# Altium schematic sheet POWER.SchDoc
size A4; SheetNumber: 2; SheetTotal: 5; SPICEModelCachePKFPWWXS: <root> / <DocumentId>PKFPWWXS</DocumentId> / <CacheFrame Number="0"> / <Model Name="tps563203_trans" Kind="CKT"> / <Text>.subckt TPS563203_TRANS VIN EN SW BST FB GND / $CDNENCSTART_ADV2 / 17f62b1fb318c25603aeb85644ae98a5d179ef807807791f6459efacb9d7ffc37a831b146dc0f06bb1ef275619162e6d8f7ad0dc708bf15ae1a1d5bd0ae623b2 / f5afd0814d8bce86ea78a61edec6d2fc1ef88bc1fe4191fb8493f4a1dd412c6bfb556be8eedb1c8ddeadffc7dd6d7cd49302c9ec7f2869ca6368ab961b9a7e79 / 2c3caf852e6007bbddfbf300b299ce4504324c546a147b82d0fd63f5f73843b5b280bb0094f9cbf6b3bb75c137eb341da51f01e1692a3f0f5357ab21ec91e28c / 2f9c76df3eefb0486bf406cd6610b812bbdef3e70d781d9ce92ba7e3f4ab8afcff2d350bbc5023681e434812074fc469fe32530ce609babdc5faa606e67e9fb5 / 70cd83725f11bc1d42e8f6733e572335c412d0e20c1d7b58214fab9eb971615763cfb3c0014b2c811add8fe5f9049282accfe11765fcb6e03701656a7ec52731 / 09bd5129c94fd3d1201b494b70afa0de60d519adf9c275ea91e8124cf70f7fa7d3b30d73fe18ddb3b40ed0a75a54c78474184e2e8b85f295eb1b3c583ef923ce / 00b83487d06f71d6f0df47a17d670e0be39eeb4d6b56bf5c6430b777c84afb9d5f327ec42498cd38024eec905a348ac82d1d589fbdc3bab015abe947d6641a42 / 36ae12f33cc0446c27b459f3dd9d5fe9da1a1277d26cdcd58a824dcbec775f4e001e6179323f31a8fcd778321d994c776ec64628f32549d1a1795120678f9f61 / 61cb9888109311ca70b8c88ae46acf6a6984f94c16c358e27027524eed01821c5fb1a81617d1d271dd181321ec41a8c96f51b1282e3dbbbae662381c2be3603a / 91b1db793b986c20ddaa8a593450d67c6984f94c16c358e27027524eed01821c5fb1a81617d1d271dd181321ec41a8c96f51b1282e3dbbbae662381c2be3603a / 4362db170fc37876f0ba3a6f255327846e0423a446892e94341c20b5ed873635253e8ea9ebb14128faf3f61aeb5d6afdf53afeecc7698bc2fda5d708d793a7ad / 45f3f38a949db782cf0a37a34cb4b1afce777453a0f5ceb5cf4270f6cd20a87c5f327ec42498cd38024eec905a348ac82d1d589fbdc3bab015abe947d6641a42 / 35475fea8b6c255631cab15e8359acc7ce777453a0f5ceb5cf4270f6cd20a87c5f327ec42498cd38024eec905a348ac82d1d589fbdc3bab015abe947d6641a42 / 85fc3fcf19e6aba9aec09af889a207db0b1b89f2cf1298d1f772fa66272e242b5fb1a81617d1d271dd181321ec41a8c96f51b1282e3dbbbae662381c2be3603a / b53cf1d4447459acdeb16b257739f88287818d550347068855ae43d551e3972173db23d861834f35706d19cd4d2361b0e892a58128de06ead42d55be8bd4092e / fde6055fa021b00159f13ed1c1b4f06cc482cdc201d5a3b43cf75803bebdd0beff5631291e78e480e41d0c5964bce8f4c60929daf44343f14daf150167c2d41a / 4cceda455955eacfd49dcb37552de3b40a953a0f07ffedcd5efa84074414a06c5fb1a81617d1d271dd181321ec41a8c96f51b1282e3dbbbae662381c2be3603a / 8ef4f3bd401a0db98afcf172f2968199212162ca8b8e19f4a5fb964338ddb170ddf3b01d73c364b8559f1cf0a40d6b2a1554413396a84c7eaa5464e7e001ac94 / 122342c2634d6b235b81d85b98ae33c0fa0ba6454dc997795c7cbef7cb3090545fb1a81617d1d271dd181321ec41a8c96f51b1282e3dbbbae662381c2be3603a / 92b245e73f4697285388a60cc54d1a2cf9d5cae23754c4b7973eee563277a269253e8ea9ebb14128faf3f61aeb5d6afdf53afeecc7698bc2fda5d708d793a7ad / b030d7f7ec807e80809a33f1e0f48d4304324c546a147b82d0fd63f5f73843b5b280bb0094f9cbf6b3bb75c137eb341da51f01e1692a3f0f5357ab21ec91e28c / a356f56b2f5efac4a113c10908a407c81ef88bc1fe4191fb8493f4a1dd412c6bfb556be8eedb1c8ddeadffc7dd6d7cd49302c9ec7f2869ca6368ab961b9a7e79 / 27577699ac96bfd769dc9ea3ff693bc054f6809f3ba2a338ae8531f223b014c163cfb3c0014b2c811add8fe5f9049282accfe11765fcb6e03701656a7ec52731 / f1da5c1c6c3fdc08c0322d47b68b6b910220e3ffea48d2478756907be69c361673db23d861834f35706d19cd4d2361b0e892a58128de06ead42d55be8bd4092e / 67ecfaa4447f34c7c0e4d59d6a34ae7d471c010d6c737d18210cc87266cf9601ff5631291e78e480e41d0c5964bce8f4c60929daf44343f14daf150167c2d41a / 4ee0a4f9940f90595435acb177473875049e4d6e50b273c83d53f3344d12762ef3a2b41ec0981b66f3ef9d7a49aefae833476f48602ca5add898620fb19febff / edbe8b41d2123721c70019bda266bd8a5d931c3789abc7c3dae88db9400efed35f327ec42498cd38024eec905a348ac82d1d589fbdc3bab015abe947d6641a42 / 574afbb14df61a9f99b8b4dfcf41013904324c546a147b82d0fd63f5f73843b5b280bb0094f9cbf6b3bb75c137eb341da51f01e1692a3f0f5357ab21ec91e28c / e3ee849839cf8fbd7594fd65ad47596fcc5ade9bf6ee20565b33cd6cc89886dd81ad21904c09afefe4e5be9d748c6f54dd6f10503e95471e00df778ebffc6776 / 22ddd3cc22c031ccef5b54aeb4248bf504324c546a147b82d0fd63f5f73843b5b280bb0094f9cbf6b3bb75c137eb341da51f01e1692a3f0f5357ab21ec91e28c / b2d692de5fb57b84ecc629e48fe2e2771ee6ee674cc49299988836ede0e32a97c3f62e6a4283e53726ebfad0bdd19fc0351ff4d82b7fddd9310a450595235bfc / aaad54eddd7ce6c56d24dbcb22fb4b351ef88bc1fe4191fb8493f4a1dd412c6bfb556be8eedb1c8ddeadffc7dd6d7cd49302c9ec7f2869ca6368ab961b9a7e79 / 5bc514dc2514d2d59b213b2e62bb1d6e4e9f666838d97e63a805ec55b0ea05d363cfb3c0014b2c811add8fe5f9049282accfe11765fcb6e03701656a7ec52731 / 42bde815bd9b10b9213acaf4a66cac3f4e9f666838d97e63a805ec55b0ea05d363cfb3c0014b2c811add8fe5f9049282accfe11765fcb6e03701656a7ec52731 / fd8ccb6aec6d817fbd7a50fb501fdaa26f0d06708f190010035fffa3d65560ef81ad21904c09afefe4e5be9d748c6f54dd6f10503e95471e00df778ebffc6776 / 2a7f0c58233275ce3330073e8b2ad1055acf8296a5506a731d449097f377703963cfb3c0014b2c811add8fe5f9049282accfe11765fcb6e03701656a7ec52731 / 4bb5198366fb4abcb65e13b5804e97816f0d06708f190010035fffa3d65560ef81ad21904c09afefe4e5be9d748c6f54dd6f10503e95471e00df778ebffc6776 / 8d523741b204ed9c0873bb14b6a448136f0d06708f190010035fffa3d65560ef81ad21904c09afefe4e5be9d748c6f54dd6f10503e95471e00df778ebffc6776 / c75098833f219e02c4cb522a54a2a4d04e9f666838d97e63a805ec55b0ea05d363cfb3c0014b2c811add8fe5f9049282accfe11765fcb6e03701656a7ec52731 / 3046f13968968d76bf373e22f2b2e0ee1ef88bc1fe4191fb8493f4a1dd412c6bfb556be8eedb1c8ddeadffc7dd6d7cd49302c9ec7f2869ca6368ab961b9a7e79 / ad726412a80e463f9526607072df080804324c546a147b82d0fd63f5f73843b5b280bb0094f9cbf6b3bb75c137eb341da51f01e1692a3f0f5357ab21ec91e28c / b80c999929450a3e27ab9264f990ec3fcc5ade9bf6ee20565b33cd6cc89886dd81ad21904c09afefe4e5be9d748c6f54dd6f10503e95471e00df778ebffc6776 / 29dbb7f9bc452ef428e53ef30004d2887763b9c705b2ca7bb0892466e755206263cfb3c0014b2c811add8fe5f9049282accfe11765fcb6e03701656a7ec52731 / 89bbde81fddca67a93411e8fac86d3484e9f666838d97e63a805ec55b0ea05d363cfb3c0014b2c811add8fe5f9049282accfe11765fcb6e03701656a7ec52731 / e37be5c7bcada9f51e1fb646d4e5305c5acf8296a5506a731d449097f377703963cfb3c0014b2c811add8fe5f9049282accfe11765fcb6e03701656a7ec52731 / bc290469ae2485b9f59860eeabffd1c3ae6eb3a6f20880f9757070053acb987c125811c553e3706b56cbd9a7d47fd599b92102186ad864fe0340588da61aa7a9 / 4f40bc9a0008bc6ff2c645645814ad4338f1fe869ea9ebd1f0ae365fa2011b52915e194a6e7710d6db70b166fa35f8dd670dadfa707a887d746ceb41a6a2bc50 / bd729cb5005c2288df15d1dc550c56fe253e8ea9ebb14128faf3f61aeb5d6afd98822bcc9d595e64d500b4de883b9f539930e10cdbd75d1f68c5e1b6488d495d / 443c1c3e040ad688d7c48ca25096a42c0f3eff7fcc807c3432ad9355abaa33bce4b1f018dad504a3a21a72b65e0dff24b92102186ad864fe0340588da61aa7a9 / 4f40bc9a0008bc6ff2c645645814ad43c0c801c380cd0a71ce3ecd7eb44ac2d5d8c8fee6ced1ee553bc7668303dad3b01995e07a960544f44eae0b9dd0bc7a34 / 850cc5dfca7143c35a7806b5e1804bd7534d047b85e7d209f8469abfd01aa604ece169451ba8821a320cf88dedd1918b982bac6ba592e8e43e804b398337b6ff / 935b2a1b30a21fa18bed7288b9ab5e324a88271ab3266812cd3aa70708bd626445b85c27301d5c6b578db1a92feeaa764865724ffc30b5e8dbca37a731b4efc3 / 4f40bc9a0008bc6ff2c645645814ad43fbc146bbd8c7709f893e653873e404e5153afabf42e2508eeeb0b7a6a6b86e6dd6f3a0a6306c81c6c3076feec66dbaa1 / 01186e5929d2f904bf9fda6b558de5cbddf3b01d73c364b8559f1cf0a40d6b2ae25ff3d6d929c50ed8a8108da413ec20b4a3dc2cb07ede75c8169066b5e197fb / 9bc7b14288bbfba2f5c4cd5c4071f57e8c8ff69d1be5fdbd8bfac51c8f93ef3c2053e60d7647caeb28973cf3b6876046b92102186ad864fe0340588da61aa7a9 / 4f40bc9a0008bc6ff2c645645814ad43bd1a798fec061608b6f81340aa58ac6e153afabf42e2508eeeb0b7a6a6b86e6d5e6facb435fa2aa06017ec4e5ee3fb18 / 8441f031bc7b462f00a1694dc24197b1253e8ea9ebb14128faf3f61aeb5d6afd98822bcc9d595e64d500b4de883b9f539930e10cdbd75d1f68c5e1b6488d495d / f0dbed4a26e33819778f1413e9422d114a88271ab3266812cd3aa70708bd626438b131636e77a500adabdd4c29525e3e4865724ffc30b5e8dbca37a731b4efc3 / 4f40bc9a0008bc6ff2c645645814ad43fb93b551dae4702a81e9786a0833bf17153afabf42e2508eeeb0b7a6a6b86e6d5e6facb435fa2aa06017ec4e5ee3fb18 / 8441f031bc7b462f00a1694dc24197b1253e8ea9ebb14128faf3f61aeb5d6afd98822bcc9d595e64d500b4de883b9f539930e10cdbd75d1f68c5e1b6488d495d / daf402055e816de6acd8abe76f410aca8c9c5c152105b305e3a8c703577eca27e4d5df311ea1a6598bfe4f09bc8e596e0a6b68b2fb13ce2ea7fadb283fb4a571 / 4f40bc9a0008bc6ff2c645645814ad43f5e9bfe9224e7b3553ffab25b5a24997153afabf42e2508eeeb0b7a6a6b86e6dd04d2df362fd58a23d4bcbd91e0a6a79 / 6dbd1664dd062f0564868103e6f1998986a1fc5abb695adc79e3acd2fca3b2a1ff4dd9cd389c6e89dcf3fd039cc536778678a6de639ddab73670661ad072216b / 9199610ccf4213168ae6a788a8f5c44971b51b0d66d00da1d7bf0a4576584bc548ab1a712455c0fd70e6d61e57a3dc250df51e4fae0520d0749c687b25cbca4b / 4f40bc9a0008bc6ff2c645645814ad43304b869a9aff372b15a68a7ec2600c59131d186592f1b6eb60dee7b70077705cb2e1b5014a3a7065c2bb17a8920cf176 / a0c610d312c5d3715761955be1e599291ef88bc1fe4191fb8493f4a1dd412c6bfb556be8eedb1c8ddeadffc7dd6d7cd49302c9ec7f2869ca6368ab961b9a7e79 / 0cfe763f3cfd2e93f5bb37a5310980984a88271ab3266812cd3aa70708bd626425aa6f665aff44f72b67168be4d496bb4865724ffc30b5e8dbca37a731b4efc3 / 4f40bc9a0008bc6ff2c645645814ad435688023da0c229ad6a86e9f6fdfe28a6153afabf42e2508eeeb0b7a6a6b86e6dd6f3a0a6306c81c6c3076feec66dbaa1 / 01186e5929d2f904bf9fda6b558de5cbddf3b01d73c364b8559f1cf0a40d6b2ae25ff3d6d929c50ed8a8108da413ec20b4a3dc2cb07ede75c8169066b5e197fb / d2198f238267f1fe2a618008047bb2300ff061f3f3de0a5db6cba0a5758ee07bae972b4bd09888270c5af103b0faa4b7e0ed063c5788fc43b68053b8adec48ae / 4f40bc9a0008bc6ff2c645645814ad43b0b807df2827f15c55a7e8c921f61adb153afabf42e2508eeeb0b7a6a6b86e6d8593677ecf272b02af7f54e7e948c43d / 50ad38041b4119e94b08a64679a02090253e8ea9ebb14128faf3f61aeb5d6afd98822bcc9d595e64d500b4de883b9f539930e10cdbd75d1f68c5e1b6488d495d / a7c8f28bc2b7e818a1f7f44414f0cab70ff061f3f3de0a5db6cba0a5758ee07b4cb8e6b4419e07f0adadc41f531cd6c968355831ef9ea0dba7bba4a5a30a9ba9 / 4f40bc9a0008bc6ff2c645645814ad436a39f7a3c6a898afadad49c0edd72a4db10aae7db9b8afa9c44e2a1e7523286a5e926174d7ad6dfed72abbf4e21dfbab / 850cc5dfca7143c35a7806b5e1804bd7534d047b85e7d209f8469abfd01aa604ece169451ba8821a320cf88dedd1918b982bac6ba592e8e43e804b398337b6ff / bc5fc397b6337f6adbc0feb7bc3ba1054c056dd9281348acbd5342c457f13a43046aa47fc8f6fe0489b4d390ba06b412c7bc1fd86ecd9bcadc8b4df765de37dd / 4f40bc9a0008bc6ff2c645645814ad43d8d5632b46ad3100a0809fc765e26830b10aae7db9b8afa9c44e2a1e7523286a5e926174d7ad6dfed72abbf4e21dfbab / 850cc5dfca7143c35a7806b5e1804bd7534d047b85e7d209f8469abfd01aa604ece169451ba8821a320cf88dedd1918b982bac6ba592e8e43e804b398337b6ff / 9eeced343e4759daf2ad17a074f4a8b30ff061f3f3de0a5db6cba0a5758ee07b8d953d51185670f8a165812491bea19668355831ef9ea0dba7bba4a5a30a9ba9 / 4f40bc9a0008bc6ff2c645645814ad43776e8d03d177d67b589cadb2b0cb8e91915e194a6e7710d6db70b166fa35f8dd771ec507d44803a4ec91050bbf66a5b7 / 61dcf9793dbde0f2206fa19cb6940fa7ddf3b01d73c364b8559f1cf0a40d6b2ae25ff3d6d929c50ed8a8108da413ec20b4a3dc2cb07ede75c8169066b5e197fb / 5dc23e741564c7246f45fc795087f4570ff061f3f3de0a5db6cba0a5758ee07b70c8982f6d83e4ebdd6c9853d7253f4568355831ef9ea0dba7bba4a5a30a9ba9 / 4f40bc9a0008bc6ff2c645645814ad43e747ad1c137ce6837394fe4b9883e3f6915e194a6e7710d6db70b166fa35f8dde1aabcdc133a0f83c41d6746a27dc1e5 / 50ad38041b4119e94b08a64679a02090253e8ea9ebb14128faf3f61aeb5d6afd98822bcc9d595e64d500b4de883b9f539930e10cdbd75d1f68c5e1b6488d495d / 49de70647d3e6b982c41ed25c9683c744c056dd9281348acbd5342c457f13a43fa99060991c3c9071b6aabbacba8e09cc7bc1fd86ecd9bcadc8b4df765de37dd / 4f40bc9a0008bc6ff2c645645814ad43773afa44fcb37285b19733d4f8dd8123b10aae7db9b8afa9c44e2a1e7523286a5e926174d7ad6dfed72abbf4e21dfbab / 850cc5dfca7143c35a7806b5e1804bd7534d047b85e7d209f8469abfd01aa604ece169451ba8821a320cf88dedd1918b982bac6ba592e8e43e804b398337b6ff / d4829582889d745b5464024feea3bd164a88271ab3266812cd3aa70708bd6264beb6d1b3d9001801d3f4859c0c799d700a6b68b2fb13ce2ea7fadb283fb4a571 / 4f40bc9a0008bc6ff2c645645814ad43b8121e14403d915318fd14111052fb4e915e194a6e7710d6db70b166fa35f8dd670dadfa707a887d746ceb41a6a2bc50 / bd729cb5005c2288df15d1dc550c56fe253e8ea9ebb14128faf3f61aeb5d6afd98822bcc9d595e64d500b4de883b9f539930e10cdbd75d1f68c5e1b6488d495d / 6dd54c94b0f547abbc79da64e6da7c2aae6eb3a6f20880f9757070053acb987c7113234daf4619b3837f18d0ada33338b92102186ad864fe0340588da61aa7a9 / 4f40bc9a0008bc6ff2c645645814ad439ed034ac9823f962dde85211cb31f9b3915e194a6e7710d6db70b166fa35f8dd670dadfa707a887d746ceb41a6a2bc50 / bd729cb5005c2288df15d1dc550c56fe253e8ea9ebb14128faf3f61aeb5d6afd98822bcc9d595e64d500b4de883b9f539930e10cdbd75d1f68c5e1b6488d495d / 7d7dda516cc8972dd58b7d9432a9be6bbe266e47d3f7e5f268d7d14c4c1d6c639d3203e339a2f933e94b5b65ac5691ccb92102186ad864fe0340588da61aa7a9 / 4f40bc9a0008bc6ff2c645645814ad43b4d17bcee0cba026d70f4716224472a4653554b0d12d27851f60985778eebf8d1d671964303b343e3c5e048369247fb4 / 4b702cef0bfcc0d861abb77c1710e51eee31fd3ed316bfaeb2b9a5877e3c5a2f45114284d51e3fff173a649a93fdbd4c9972bd5f5e28bf530b222f02bb021251 / 4e97fe54067940d436d2b2dd7532d7c60656db43821a56ecf1676df93a19ca1b97acd2d5e16f215830726433e3958d8059dc634feda8c818bc301584fad81db2 / 22f315950ea606d65ae24f69b744ad921428ec750a4fa3dfe6607087d2b42c9ebe0b809f91da1c4df177b482042cd434b9f0be247cbc8132900859dbb1ed8d85 / 97eec20665e30d167749e945d65fa81e417827ed32327ba13170a97b235162c95cf15afe746fc04ad73aee93bedef2f479fbc15dc56ced58e3c894eba972b1c3 / 556dab919dc96430eaf2e18a370294a61ef88bc1fe4191fb8493f4a1dd412c6bfb556be8eedb1c8ddeadffc7dd6d7cd49302c9ec7f2869ca6368ab961b9a7e79 / a61ac8209b8a7a0e80ba48482a265e641f04417185689dd5f1937aa905f3ad2ad0ff33a1c19f80c375b04a71feb2ec8347afea7d5671673d314b1cb593c136e8 / 9b875c960cd6e07ac7f8d65c236045271f04417185689dd5f1937aa905f3ad2a297ba2c3cdc7ecf80c787dd1074ab17108f2029b4a58bcf7499105774c4e28c9 / a3d3431ca43ec6c2003c11fbdb9b249d05eb429c3ce34acf1eae17dbbc308efdfe1d2d63e7e4149c617b3cb57d8ca7d0dbc55a83617f255ca260d632aac5274a / 6a27dd9406cbba8a469904c5e4d57001f10c3b627d81c4878d0cf2712b73727363cfb3c0014b2c811add8fe5f9049282accfe11765fcb6e03701656a7ec52731 / 502025baac339f12c3d9672de9213761679a14dac9d7f4f2680353f6a05365d77f0a945b95db863cca2303ff910e984f0facccc28e1acac46dc91ab7e38432e0 / 0c1bd359af34ac36d25762bb7cc2343e4920320521d303ac4ff1cb87dbdb830b5fb1a81617d1d271dd181321ec41a8c96f51b1282e3dbbbae662381c2be3603a / cded41125d343f0b6f0721ca77245de41dcec64a1fac1b4e3e8b78af6a9b5746183cee42588b6ad598a16032c9b23a4d27603cfc9eae3c824a067c07d4956268 / 2cd819585e9e46af35fd7e810d638154f1fc5f7135518302c181aacc3feea90a9bfe0fbce1feafcb6a5bc0f281db92c3ae01f2200a2eb1c980cb8c85a646fe3c / e2b57a0732ad7ae0c3097f5ca773bf491122ae25f74a12a34cad6f7191c7c43286a1fc5abb695adc79e3acd2fca3b2a112e56616ffbc1b63fb918528add79cdf / 1dd19b65c80c2ea922730c8f8c4b35f2c78806ab3e51e11a05bdeb33d4ed4680eae120e21a7b8212f995bea9ed65dd2d0e3252940cc15fee77b95a2c1995bb08 / 1a6927d4845433c95126164527e2adcb7be7bf39ce98ba50bd3f01f2820db3bb73db23d861834f35706d19cd4d2361b0e892a58128de06ead42d55be8bd4092e / 05a0c7dc026d94472df85a56c999fbba688a889546c180019a9dfad70d243ff3eae120e21a7b8212f995bea9ed65dd2d0e3252940cc15fee77b95a2c1995bb08 / e45023c91df040de8841ffded4def998d22de86809ab88d255a6a07ff792291dddf3b01d73c364b8559f1cf0a40d6b2a1554413396a84c7eaa5464e7e001ac94 / 1459db07b9e9dfbf1c679dd11090ad4460f5fbe7c02f6d47abbaa13455fef1aa183cee42588b6ad598a16032c9b23a4dfe4a4b982111167e20578131ca09cfd9 / 054e3fbad952bab1923566744349424b63cfb3c0014b2c811add8fe5f9049282d30186341acfb4f94922bd7bfd306e475c546c9b8287dc4cd3bbf29ece045c2a / 6f346b05ac69578621ae277f76949718254d6cde91d62639f28772144fa9e781584b4580c3c881d2771c0946e80aa7324c839004d988aea1ab3ea61f8824206e / 3935631c2dd562f9286bc12f63c8fe784a17cd988afa22f9c0245ba1a71436f381ad21904c09afefe4e5be9d748c6f54dd6f10503e95471e00df778ebffc6776 / d906fff941905edd6df37b519b9424a22466e642609fd88feed7f9e0cf2cb6141fda0689db1dee3c3427cccf450d15c27a54b4a62a9eb7107154f5a69bc004fd / 1fcdb0bfaefc06fc37b11516a344a652f0793c552f2b942ca8cc3c5dbcb25209e3dbd4da3a734350a081c7f96caf752efe32530ce609babdc5faa606e67e9fb5 / b7e129d9ce6a8a1244d0cb185d0f0201792737826ad797d53e5330408f348c0647c2234b0a69ef047439240b1dff40a90d78be1ecf1f2d2dc25fa36bab6d2701 / 9d3881efff8e293073f79c46e4f12d715fb1a81617d1d271dd181321ec41a8c9db1245f7361fce9862b2aeabd5851f54ab77712fbe0ab2e2b1e362c201739267 / 3399057be69705358ff0d5a71e8510b238fdb50804919581d362a1b670f565c04dccab11fec81a781d2ab0678f38ae020e3252940cc15fee77b95a2c1995bb08 / e45023c91df040de8841ffded4def998d22de86809ab88d255a6a07ff792291dddf3b01d73c364b8559f1cf0a40d6b2a1554413396a84c7eaa5464e7e001ac94 / 2605a3d1503ba296faaff25f7346171eb7c2a825d83e46a0a2c121717b13273f183cee42588b6ad598a16032c9b23a4dfe4a4b982111167e20578131ca09cfd9 / 054e3fbad952bab1923566744349424b63cfb3c0014b2c811add8fe5f9049282d30186341acfb4f94922bd7bfd306e475c546c9b8287dc4cd3bbf29ece045c2a / e8852a8b4188c2ec3a1e96a4fc58471bd6c1147c5619575b8cc1557b9d649d32986c44742748a4d891678d5bcca90093f3497ab323fbeee13bc994fc574739f3 / 77344bacd2ca5f8cce01c447ae6a18321feac32d64576ad82fa13588a1fadc13d9c57969d8b9a5293b3ec74b5b2f8311204df1ad93696e5693e1c28a1b105735 / ffbf8b4a4a7479edd77a83b184249d9f4d22c9ccc5db7d47f62a454dcec9fe17183cee42588b6ad598a16032c9b23a4dfe4a4b982111167e20578131ca09cfd9 / 054e3fbad952bab1923566744349424b63cfb3c0014b2c811add8fe5f9049282d30186341acfb4f94922bd7bfd306e475c546c9b8287dc4cd3bbf29ece045c2a / a68619453646d747412e6a3e964b0c16160a482a7dd4c8158588be715eb42ab6b36eb56a2d05e04f7d0cb169409ab94abf2a989a2afc1004e4df51ce62646a9b / a7b7bfbd14990d2a062155765a90f0798e6c290abd264d4edcfbbfad94316280ee31fd3ed316bfaeb2b9a5877e3c5a2ff31b3451780f235ddd8fb381147eda74 / cb243c178961921ffee6ea7b4aafe8d9fac07d036914d85c9aadf1473b30e7a1074df99044a8d6644a88269b442e21b7769c46d6f94ab0e9914593d273f901a4 / 38c0c0104dee6215aac74457ac51eef39d13ba70339cb3141945d0cbfc96ba3c5df6a6a7a0a32c767a53943ba1c033c374068da8be66bca97f166aa37e1f109f / 17b32a0088388fc1cb1d06604ef7b097ff5631291e78e480e41d0c5964bce8f4f34565b10cadf13b48e3bcb31832207da0fc180a7ae8c47c7a119fb36ec70147 / 45c21244193298c308ec64b6a14920fc7a7a3acfdbc684a55ae84fd6d3210ed21fda0689db1dee3c3427cccf450d15c27a54b4a62a9eb7107154f5a69bc004fd / 1fcdb0bfaefc06fc37b11516a344a65268ac89bc460ec8ce71985734edf25acbda1a1277d26cdcd58a824dcbec775f4e121d5ac60bc3e64d6efaaa3660106ef9 / e4d7630eff925acc04eecc01489f79beb9fcf5e3784f75b17e0627e185d1aa1647c2234b0a69ef047439240b1dff40a90d78be1ecf1f2d2dc25fa36bab6d2701 / 9d3881efff8e293073f79c46e4f12d715fb1a81617d1d271dd181321ec41a8c9db1245f7361fce9862b2aeabd5851f54ab77712fbe0ab2e2b1e362c201739267 / 3417584568c1237a6df57f7c7eb12d5aa6de79dba77313799764f00d24f4b1c091d5803384fbe1b3a08ace92c91489faf82fc7b6a4d60b17343fd668bf6dd3bb / e388c60aa9a280391c9c0354d64217e998eee6ef43dd82982780f1c9684a9b73da1a1277d26cdcd58a824dcbec775f4e121d5ac60bc3e64d6efaaa3660106ef9 / a37e7507fda5feda9fc516a4aaa72d0ccbf8b6ddf37e8ef1ad481609550e7d7f074df99044a8d6644a88269b442e21b7769c46d6f94ab0e9914593d273f901a4 / 09426cdb112ae1a409f1eb8f881a65c660f4c2930e676e988a75fc42a78d9a225491ec8384fb6d6e4fc05bfbafee14ad5ea95b91330e9a4616da17eca4026823 / 7ad82854c301b359b8c0a7d0beb42103e78ee0e598972f0e64f8dc42701507e21ee6ee674cc49299988836ede0e32a975eb9618482f4f56256f57c5bfc39ccdd / 50c3d426cc606eabdcbb8ffcb92b8a4205adb9bc0ef2c0ab46bd9a25c97c467fdde10b94659b9664b97323b7b2caa73808a523d41a02047340c62c2df51ea280 / 508c7f3d38d35dd98fd025169e991c165f327ec42498cd38024eec905a348ac8de8783016e41167af7d19112acc1f059855e7acae9b01c3bc1c97147687c1742 / 277838b8121a86a2010a6b70679ebb38cae4c98dcd36b4fa2cd77cb13b2f8700cd2538089de6fd509e9f7f8383223d1078ae20d3cfe407b9d249455ed6c00621 / 442f1dc9461d4ea633f51111f4dfc81d22f315950ea606d65ae24f69b744ad9221767bee57739328024ccd4e28d2c06b0df51e4fae0520d0749c687b25cbca4b / 4f7f44d30e2edb79c6f67e8c83655ee4b309543e4bff00e7baaada2a51af3c3edde10b94659b9664b97323b7b2caa73808a523d41a02047340c62c2df51ea280 / 508c7f3d38d35dd98fd025169e991c165f327ec42498cd38024eec905a348ac8de8783016e41167af7d19112acc1f059855e7acae9b01c3bc1c97147687c1742 / 260e82911d58982a67757de350677046d826aef484c6055e4e24b3c3be53bb2df06de11028469f18b0d5dc3dae1ff0793154af5525668afb677ec4abd7ccd7c5 / 22f315950ea606d65ae24f69b744ad9221767bee57739328024ccd4e28d2c06b1ef88bc1fe4191fb8493f4a1dd412c6b719c790af337e341f39cecf0aeba89dc / 0dd10adac699b11c05b64ea1227c5eb71061a5a43a748ac8a593faf150f75d25183cee42588b6ad598a16032c9b23a4dfe4a4b982111167e20578131ca09cfd9 / 054e3fbad952bab1923566744349424b63cfb3c0014b2c811add8fe5f9049282d30186341acfb4f94922bd7bfd306e475c546c9b8287dc4cd3bbf29ece045c2a / 8285340413c6de8e54ef81a9cec507aef1fc5f7135518302c181aacc3feea90a9bfe0fbce1feafcb6a5bc0f281db92c3ae01f2200a2eb1c980cb8c85a646fe3c / e2b57a0732ad7ae0c3097f5ca773bf49440b366da56b23ddd1e7420555ca688e534d047b85e7d209f8469abfd01aa604b50d05cb8596d6a1d8b243fb69aff8e1 / ae9bc377f182d9990a16ac30188926de4752628384436897ece7c14797b09b2247a7eb3c5526848655966c96d0774fb27a54b4a62a9eb7107154f5a69bc004fd / 1fcdb0bfaefc06fc37b11516a344a652d3516f02a15a55d6f419736f9e4831e986a1fc5abb695adc79e3acd2fca3b2a112e56616ffbc1b63fb918528add79cdf / 73c3f0d36729e0e4dfd6b20c6d19c6f148e91eea952b64e9f0dc1c05106e66ef183cee42588b6ad598a16032c9b23a4dfe4a4b982111167e20578131ca09cfd9 / 054e3fbad952bab1923566744349424b63cfb3c0014b2c811add8fe5f9049282d30186341acfb4f94922bd7bfd306e475c546c9b8287dc4cd3bbf29ece045c2a / 447ad544f03fb85199f8510d0f067c0e8ac35904555c77d06a2b4f0cb2515fcd59fdf7e03b2efed08b93236e51652c2b5d3c50dc85d80124b49fe96043a03b8d / 3ba3f6221b0ee11791647974fa8ac64f5a63e80e1ef6a56e89bdb3052ea17e0247a7eb3c5526848655966c96d0774fb27a54b4a62a9eb7107154f5a69bc004fd / 1fcdb0bfaefc06fc37b11516a344a652d3516f02a15a55d6f419736f9e4831e986a1fc5abb695adc79e3acd2fca3b2a112e56616ffbc1b63fb918528add79cdf / 07fc384c0cff7c03a96ec88fc50c6a65bc086f72087fea5a0ae422bd651d3fa7183cee42588b6ad598a16032c9b23a4dfe4a4b982111167e20578131ca09cfd9 / 054e3fbad952bab1923566744349424b63cfb3c0014b2c811add8fe5f9049282d30186341acfb4f94922bd7bfd306e475c546c9b8287dc4cd3bbf29ece045c2a / eacda1fc6ddc0efe2e7b45b382a2b2c1334ac4e77e1ccb50ddcf483012ff5d40eae120e21a7b8212f995bea9ed65dd2d0e3252940cc15fee77b95a2c1995bb08 / e45023c91df040de8841ffded4def998d22de86809ab88d255a6a07ff792291dddf3b01d73c364b8559f1cf0a40d6b2a1554413396a84c7eaa5464e7e001ac94 / 560ac0c14eab392fdb78babd3bebd9983032ad7e503ac41b4cd5d41f70b10d4e183cee42588b6ad598a16032c9b23a4dfe4a4b982111167e20578131ca09cfd9 / 054e3fbad952bab1923566744349424b63cfb3c0014b2c811add8fe5f9049282d30186341acfb4f94922bd7bfd306e475c546c9b8287dc4cd3bbf29ece045c2a / e33a20ec83275f1c1316686687a01fa3be523d1bf44933f2e2c42d5ea0b7f3f8ed7ad5a67ea8915e1ebc123c6c5ad97716ee9602cfd575e9b4be4306e34c7cfd / 2d0af283f943bb425b72fe74c2cc631a8c5ae638d9c5f7d0e36e644af03b6c4164c2eef8f5c9e0dad9758640e7722602883f1732a954a55429fc27dda3a3802d / f939322fb37e81de9f103777da7e2e0dff5631291e78e480e41d0c5964bce8f4f34565b10cadf13b48e3bcb31832207da0fc180a7ae8c47c7a119fb36ec70147 / 6658c790a681e35bd02354e762e77b816de1ee24a4616ae34ddbc61915a4af72eae120e21a7b8212f995bea9ed65dd2d0e3252940cc15fee77b95a2c1995bb08 / 1a6927d4845433c95126164527e2adcb7be7bf39ce98ba50bd3f01f2820db3bb73db23d861834f35706d19cd4d2361b0e892a58128de06ead42d55be8bd4092e / 70a88d46f8bdf757d3c2525038d1a5c42af3d64ec7f3438e673bbf475d73c02a935de6ec77574d27d501f825187420294e32c93321e74c5f92bd636a3f6e9b3c / 5cbccdc7c2c65c86b69b1006dede4c1f9f79dd1ee23d0341a06351e3e6432d71986c44742748a4d891678d5bcca90093f3497ab323fbeee13bc994fc574739f3 / 77344bacd2ca5f8cce01c447ae6a1832e895e8fb537745df31f4f65516aa62d3da1a1277d26cdcd58a824dcbec775f4e121d5ac60bc3e64d6efaaa3660106ef9 / f9a9e9cac404abea5664ce74680d97c8a98534c2f386b873f5b7d8d26ae98c23183cee42588b6ad598a16032c9b23a4d27603cfc9eae3c824a067c07d4956268 / dd7e24a97214fb8482b07c0e511d21a51402403dcd5771596cc89b97dfc133e25491ec8384fb6d6e4fc05bfbafee14ad5ea95b91330e9a4616da17eca4026823 / 7ad82854c301b359b8c0a7d0beb42103e78ee0e598972f0e64f8dc42701507e21ee6ee674cc49299988836ede0e32a975eb9618482f4f56256f57c5bfc39ccdd / 83a62641809708d4202df6b70561c8d7229452aa2b1a5191fc3f90578b8a87d29a8ce326f45b0db9dad4f274cf72c8ea74068da8be66bca97f166aa37e1f109f / 17b32a0088388fc1cb1d06604ef7b097ff5631291e78e480e41d0c5964bce8f4f34565b10cadf13b48e3bcb31832207da0fc180a7ae8c47c7a119fb36ec70147 / de694f7c4478a38d2cdcde1a33d8f0556dd02d133c3814398ab7fe4cd4ccdbffd6a6d2aa8fddbdc7d41ae4f2f9f9fc6712edb0569464a273ae1b706ed612faee / d0cf526bf5908923399a8bc7f26e951d86a1fc5abb695adc79e3acd2fca3b2a1ff4dd9cd389c6e89dcf3fd039cc536778678a6de639ddab73670661ad072216b / 761685ee826fd585e75641a5e6f7c90e8e3cd78bde57a504d6ea7bd3f0b4c80eb83fd581f52748df50b10b9461b0143a31a62f3809a6acdf4cf68bbddb3c8d31 / dea89cb58c551a285e933e11dcd48f655f327ec42498cd38024eec905a348ac8de8783016e41167af7d19112acc1f059855e7acae9b01c3bc1c97147687c1742 / ed4a59a8cb674343c5b359bdd70c49e38e3cd78bde57a504d6ea7bd3f0b4c80eeff14c82b9479cb8c949c621382dd59a973aa354ac7b7bee8bcdcb0aabc58974 / f280f95202d4e704046932697688ecfac182ba38ef19b391b7c25f1795bd8a40416f3054b6d62ccecd6a989bc131821a0e3252940cc15fee77b95a2c1995bb08 / 4ad700470c7f1976fb08aa78c34724be21ce3ef9c774afd2e72a37d7bf9f35d516730706153b3f033a5f4a97c07dbaa9c6a07c860da0a495285bd13b1a4243e0 / e3712e234236e37293976351f9e0e3f2bbda188c5d38eb536e4696b2f1e83b5747c2234b0a69ef047439240b1dff40a90d78be1ecf1f2d2dc25fa36bab6d2701 / 9d3881efff8e293073f79c46e4f12d715fb1a81617d1d271dd181321ec41a8c9db1245f7361fce9862b2aeabd5851f54ab77712fbe0ab2e2b1e362c201739267 / 39fff3deeffaee2cfae905c61a6ac40f8ac35904555c77d06a2b4f0cb2515fcd81da267900d0f4956fabc08808dfd60d3024494440f8f524c16574a13a189a5d / 0af3075bc68f4b63ed556eee90db5aeb8c5ae638d9c5f7d0e36e644af03b6c41f4313a6e78054494132ee5e6882d3bd3189f8df53e7812b0a02aff07e72182c4 / abdc710c74eac46ffdaa6b760bd3bd68341707bdd7fdd852d35a000c725e589781ab7a94aaf7da5bef9cea20b3f19b686534fc400d01fa414a9fb605b2d826a0 / 0a46eec38a8929f4db1e298807d99ad9615f6aa47309e38d52c2c3c2183c56404920320521d303ac4ff1cb87dbdb830bb9f0be247cbc8132900859dbb1ed8d85 / 131dce04646ab8d1ed86bc8ff6bd8a07fc3e5f172672d0e7e844f65cfe773bb8183cee42588b6ad598a16032c9b23a4dfe4a4b982111167e20578131ca09cfd9 / 054e3fbad952bab1923566744349424b63cfb3c0014b2c811add8fe5f9049282d30186341acfb4f94922bd7bfd306e475c546c9b8287dc4cd3bbf29ece045c2a / de3ab996e993a5c9b0a6cb6289f9bda80ec3552d6dc09025aaefe9d93b00fb27b44bd6b4ea77619165b489fd29c664a85ea95b91330e9a4616da17eca4026823 / 7ad82854c301b359b8c0a7d0beb42103f0b0d9cf3b3abf991ca2a13732f996f841243285da6edebbeeec25e3e023081174184e2e8b85f295eb1b3c583ef923ce / 33c7d09cc773767f38436aebb07f7512e2260e98a4af6f03a1c05c7cfd54fcf547c2234b0a69ef047439240b1dff40a90d78be1ecf1f2d2dc25fa36bab6d2701 / 9d3881efff8e293073f79c46e4f12d715fb1a81617d1d271dd181321ec41a8c9db1245f7361fce9862b2aeabd5851f54ab77712fbe0ab2e2b1e362c201739267 / 551f0f0e9640cba667e52766490a5216254d6cde91d62639f28772144fa9e781584b4580c3c881d2771c0946e80aa7324c839004d988aea1ab3ea61f8824206e / fef871566538de36f5171509156d7102da1a1277d26cdcd58a824dcbec775f4e001e6179323f31a8fcd778321d994c776ec64628f32549d1a1795120678f9f61 / 1b116e5e25c7a544ac39fa132c0ddd59421af5c44b849d6d4c00fdd7bd0251fc97acd2d5e16f215830726433e3958d8059dc634feda8c818bc301584fad81db2 / 22f315950ea606d65ae24f69b744ad92d1be70122c5a95a541232bb9b503a4dabe0b809f91da1c4df177b482042cd434b9f0be247cbc8132900859dbb1ed8d85 / 06884fb4550c332123241913a5bf9f7393f267ed98750605662955f83ef3c3849bfe0fbce1feafcb6a5bc0f281db92c3ae01f2200a2eb1c980cb8c85a646fe3c / 68d7243cf527d31dd086166f1854b214ddf3b01d73c364b8559f1cf0a40d6b2ae25ff3d6d929c50ed8a8108da413ec20b4a3dc2cb07ede75c8169066b5e197fb / 666e69347f878ade53627b27bc1ea4aaf1fc5f7135518302c181aacc3feea90a9bfe0fbce1feafcb6a5bc0f281db92c3ae01f2200a2eb1c980cb8c85a646fe3c / e2b57a0732ad7ae0c3097f5ca773bf49440b366da56b23ddd1e7420555ca688e534d047b85e7d209f8469abfd01aa604b50d05cb8596d6a1d8b243fb69aff8e1 / 8ef055b3684c4fddbccc3bfea6f088368ac35904555c77d06a2b4f0cb2515fcdeba3ac37e08cebfd19838451cd4af4ea2accfcab92f2cfe09e7a5f6764c5d12d / 9c08c7fd4c923cf04d53041b909f06175fb1a81617d1d271dd181321ec41a8c9db1245f7361fce9862b2aeabd5851f54ab77712fbe0ab2e2b1e362c201739267 / 6850219f510fd76bd20371290774cc037d62600bd418bf3a7453da8f484558271fda0689db1dee3c3427cccf450d15c27a54b4a62a9eb7107154f5a69bc004fd / 1fcdb0bfaefc06fc37b11516a344a652bea83ab9bdbaa82221d826c44d0898045fd27da9c1aded19407cd2b085950b9b2d5c61cb1a1aa3b34667de65609133bb / f95a8ec7cd4d0401981d4796e5cc691c0377a14f3515871bff034aba2ebcda0447c2234b0a69ef047439240b1dff40a90d78be1ecf1f2d2dc25fa36bab6d2701 / 9d3881efff8e293073f79c46e4f12d715fb1a81617d1d271dd181321ec41a8c9db1245f7361fce9862b2aeabd5851f54ab77712fbe0ab2e2b1e362c201739267 / 9b2f56bf2a326c11503ba3777ab6237e879a016d42beb9ec94c01310e7432b1058035fbaa3cbc5d069a503c23a28b20094012c5c7f1bf0d854fb6e1835c28b0b / 61b0dbe90f4a4b87f79efecfd255462d534d047b85e7d209f8469abfd01aa604ece169451ba8821a320cf88dedd1918b982bac6ba592e8e43e804b398337b6ff / 78384807ca52687c6b7d6a8f75ba429da747f982ddf8a2d0141a6d1c8914fd0b7f550aa24985a5532dfccf73c3fadd165ea95b91330e9a4616da17eca4026823 / 7ad82854c301b359b8c0a7d0beb42103f8a9f70c1eb782b218a263bd95e274c481ad21904c09afefe4e5be9d748c6f54dd6f10503e95471e00df778ebffc6776 / adbbf497a112b9596538b0eb1d69ba9d031e8decb36facf1ae4a9f07ace36fc8d9ae2f0f66e330cea1533f39a3a8469c18b7be607854556f626c00063f817c99 / 9a8ce326f45b0db9dad4f274cf72c8ea7ad82854c301b359b8c0a7d0beb42103f8a9f70c1eb782b218a263bd95e274c4fe32530ce609babdc5faa606e67e9fb5 / 07f1c7d4206ec9679ff9ec5ac369ed1a2adf42438ff07b7d3f5ac901f8337ce647a7eb3c5526848655966c96d0774fb27a54b4a62a9eb7107154f5a69bc004fd / ec6d7e0c113c700f26aae2c8f6032b30f04f28e37444ecceccbedb2d8d3ad4e3253e8ea9ebb14128faf3f61aeb5d6afdf53afeecc7698bc2fda5d708d793a7ad / b6ea21d9bd39bf7e26922b8eef1816b140ca15540f47d79ee461c8718efebdc5074df99044a8d6644a88269b442e21b75f3290a1c8ee82050b83436c34a9f97c / 5cd15c52e2548aba21b5f9f8e4e260e83bd0213365f41b61e4bf4401f18ef8e4afd4c7f3da5a8e3c2d119daf15b310f67bec006570d596f291400a9602d2e95f / e395c577eafc8490e1e56202c444576586a1fc5abb695adc79e3acd2fca3b2a1ff4dd9cd389c6e89dcf3fd039cc536778678a6de639ddab73670661ad072216b / d7692aa51d7f6664fb5894d86c62aeb9ac49e9ce4f5ecac4704e54d8d10cc3dd7f550aa24985a5532dfccf73c3fadd165ea95b91330e9a4616da17eca4026823 / 7ad82854c301b359b8c0a7d0beb42103f8a9f70c1eb782b218a263bd95e274c481ad21904c09afefe4e5be9d748c6f54dd6f10503e95471e00df778ebffc6776 / 7866a633046fff3ab8fc42b55ede3055ee2e70f4329c922a022a101586f11066d9ae2f0f66e330cea1533f39a3a8469c18b7be607854556f626c00063f817c99 / 9a8ce326f45b0db9dad4f274cf72c8ea7ad82854c301b359b8c0a7d0beb42103f8a9f70c1eb782b218a263bd95e274c4fe32530ce609babdc5faa606e67e9fb5 / 48024200da6467f5f53cae059b72237b8330a2b530f83bfc4fc9ec0ad839aeb17f550aa24985a5532dfccf73c3fadd165ea95b91330e9a4616da17eca4026823 / 7ad82854c301b359b8c0a7d0beb42103f8a9f70c1eb782b218a263bd95e274c481ad21904c09afefe4e5be9d748c6f54dd6f10503e95471e00df778ebffc6776 / 8b9dd472f6acf60a480e716ab3e52d6e98fd8db555e461fd687e3fb428294c2dd9ae2f0f66e330cea1533f39a3a8469c18b7be607854556f626c00063f817c99 / 9a8ce326f45b0db9dad4f274cf72c8ea7ad82854c301b359b8c0a7d0beb42103f8a9f70c1eb782b218a263bd95e274c4fe32530ce609babdc5faa606e67e9fb5 / 8c49fce688db8eb825780ec4592aab8e9111120d549e18c3ca4056a72fdf205c8393103dae7a1977c4b2d61b9df3bcc7445d798484d9362aae85b40e4d749868 / 3b34c176919ee202604faf3201a6a161e39a120c7bea70ab14925ae78faa3ca2e3dbd4da3a734350a081c7f96caf752efe32530ce609babdc5faa606e67e9fb5 / 7f0178f3bb01499d3403e3eee8a3caf7df9e368ced9254db9b9a43c9ed64e073584b4580c3c881d2771c0946e80aa7324c839004d988aea1ab3ea61f8824206e / 620fb19313f88b9e545e7b2794d60e5a253e8ea9ebb14128faf3f61aeb5d6afd98822bcc9d595e64d500b4de883b9f539930e10cdbd75d1f68c5e1b6488d495d / 63e8908cf5053c03a1f0d06f40f899719e6d5974502af0b6dcd709593f72b1d06dff4cedd48ca0f81bd01790d8304f1a90343d221f4def81b53e645327564fd6 / dbeca183b3ba1c57e8fd9f88779b1d950f23041d45dcad8c302ce3e0e30be50aa6e051171d5579f1ee4173f945a0d218204df1ad93696e5693e1c28a1b105735 / 61474250bcc1339e79ebb593f825f32808c4e793ceaebb9bd03da4b0c4b3c526584b4580c3c881d2771c0946e80aa7324c839004d988aea1ab3ea61f8824206e / 620fb19313f88b9e545e7b2794d60e5a253e8ea9ebb14128faf3f61aeb5d6afd98822bcc9d595e64d500b4de883b9f539930e10cdbd75d1f68c5e1b6488d495d / eb7db98b44a923136e1b4832e556817bd166577c9578f9df30e2eb4ab8a03bedaf04bd7d517c376eb71ede4ecd74481ef3937570ab8bc306cf89bcdb76915e46 / ab857b0f8c9a3196d84d80d435e36a5b55df81d899ab1a69c67e51cbf6cd2bd8f3a2b41ec0981b66f3ef9d7a49aefae833476f48602ca5add898620fb19febff / 2c0e6cd0d7ed2f1dcf845e42800ec68b1ff8b0f6770f9a9d32af04ca996c9ffa584b4580c3c881d2771c0946e80aa7324c839004d988aea1ab3ea61f8824206e / 040bc56bfa254e54f0052d8911b4806ea6229192c4bbec817e3efe49628816f8ddf3b01d73c364b8559f1cf0a40d6b2a1554413396a84c7eaa5464e7e001ac94 / 8775addd7a85b71462fe8029f61f8b53de209f2f6fc0c028ac424eca5db98a1147c2234b0a69ef047439240b1dff40a90d78be1ecf1f2d2dc25fa36bab6d2701 / fee644bfd2361cbc3a71a6f9a5b4dd99ee31fd3ed316bfaeb2b9a5877e3c5a2f45114284d51e3fff173a649a93fdbd4c9972bd5f5e28bf530b222f02bb021251 / 137899ee4d1870157fa0ad2e3d3226625df45b7378c632090f10e254e08d17ca91d5803384fbe1b3a08ace92c91489faf82fc7b6a4d60b17343fd668bf6dd3bb / e388c60aa9a280391c9c0354d64217e998eee6ef43dd82982780f1c9684a9b73da1a1277d26cdcd58a824dcbec775f4e121d5ac60bc3e64d6efaaa3660106ef9 / 17d14c2aefe73c1f777d5c5c7f427de43a32d1864d4b42151d8bdd138da82092074df99044a8d6644a88269b442e21b7769c46d6f94ab0e9914593d273f901a4 / 9dc87db6b526907754ea5ee9d5920e94ddadb0ba702a329846fd1b1538b662d7074df99044a8d6644a88269b442e21b78a6f05c10ab17eb919390f02e5461616 / e78ee0e598972f0e64f8dc42701507e21ee6ee674cc49299988836ede0e32a97c3f62e6a4283e53726ebfad0bdd19fc0351ff4d82b7fddd9310a450595235bfc / 5ea111c2c7a71f1a9e3ddef7ffcf58dbd374b682f9a5a428310b23c3cc6a24d4074df99044a8d6644a88269b442e21b78a6f05c10ab17eb919390f02e5461616 / e78ee0e598972f0e64f8dc42701507e21ee6ee674cc49299988836ede0e32a97c3f62e6a4283e53726ebfad0bdd19fc0351ff4d82b7fddd9310a450595235bfc / 97e61610b0613a26d8f6551e4974a0b404324c546a147b82d0fd63f5f73843b5b280bb0094f9cbf6b3bb75c137eb341da51f01e1692a3f0f5357ab21ec91e28c / a8e7757860ee60bff010fbddcea8950e1ef88bc1fe4191fb8493f4a1dd412c6bfb556be8eedb1c8ddeadffc7dd6d7cd49302c9ec7f2869ca6368ab961b9a7e79 / 48da95fe3f6ea8fd0e0552d382dc9563359efdd41219def20added75b6c6e64363cfb3c0014b2c811add8fe5f9049282accfe11765fcb6e03701656a7ec52731 / 3f092a60c72125f0a100f3a1f27baab604324c546a147b82d0fd63f5f73843b5b280bb0094f9cbf6b3bb75c137eb341da51f01e1692a3f0f5357ab21ec91e28c / 1941fe012b0dbd8e4385ab702207a1fa1ef88bc1fe4191fb8493f4a1dd412c6bfb556be8eedb1c8ddeadffc7dd6d7cd49302c9ec7f2869ca6368ab961b9a7e79 / e0439042f4f7a6e124941e45fcfc4fd61ee6ee674cc49299988836ede0e32a97c3f62e6a4283e53726ebfad0bdd19fc0351ff4d82b7fddd9310a450595235bfc / d62282cbccced4998630fe3811520b3e534d047b85e7d209f8469abfd01aa604ece169451ba8821a320cf88dedd1918b982bac6ba592e8e43e804b398337b6ff / 5ca8a0704b70eda4ae5aa4737e8b6ea07bde5bc49077214e53d1b928dbb89551ddf3b01d73c364b8559f1cf0a40d6b2a1554413396a84c7eaa5464e7e001ac94 / $CDNENCFINISH_ADV2 / .ends TPS563203_TRANS</Text> / </Model> / </CacheFrame> / </root>
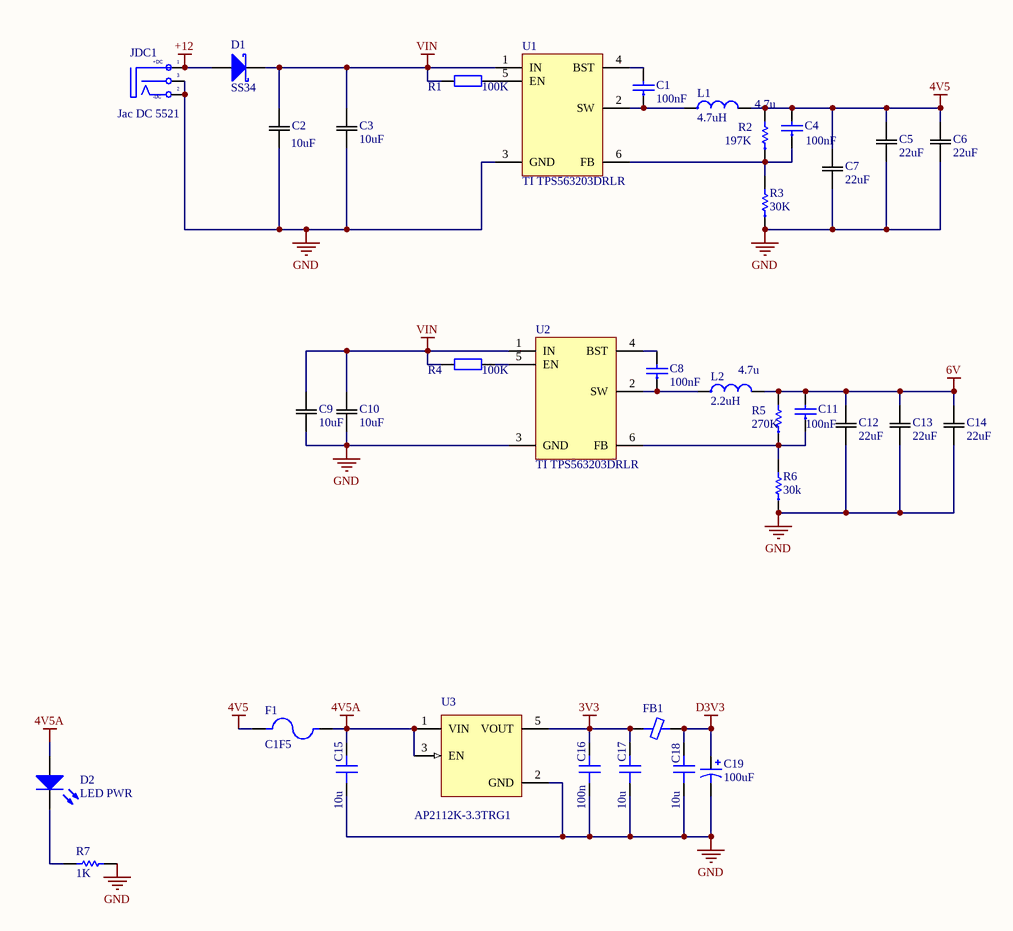
[diagram p0: POWER.SchDoc]

## Parts
C1  100nF  [CN-SMD-0603]
C2  10uF  [CAP_CL10_SAM]
C3  10uF  [CAP_CL10_SAM]
C4  100nF  [CN-SMD-0603]
C5  22uF  [CN-SMD-0603]
C6  22uF  [CN-SMD-0603]
C7  22uF  [CN-SMD-0603]
C8  100nF  [CN-SMD-0603]
C9  10uF  [CAP_CL10_SAM]
C10  10uF  [CAP_CL10_SAM]
C11  100nF  [CN-SMD-0603]
C12  22uF  [CN-SMD-0603]
C13  22uF  [CN-SMD-0603]
C14  22uF  [CN-SMD-0603]
C15  10u  [CN-SMD-0603]
C16  100n  [CN-SMD-0603]
C17  10u  [CN-SMD-0603]
C18  10u  [CN-SMD-0603]
C19  value 100uF  [CAP-ALU-SMD-5.5x5.5]  (hidden comment: CAP ALUM 100UF 20% 16V SMD)
D1  SS34  [DIO-SMD-106]
D2  value LED PWR  [LED-0805-Red]  (hidden comment: LED Red)
F1  C1F5  [RES-SMD-1206]
FB1  330  [IND_BLM18KG331WH1D_MUR-L]  (value not drawn)
JDC1  Jac DC 5521  [DC0]
L1  4.7uH  value 4.7u  [Inductor_SMD]
L2  2.2uH  value 4.7u  [Inductor_SMD]
R1  value 100K  [RES-SMD-0603]  (hidden comment: RES 100K 5% 1/10W 0603)
R2  197K  [RES-SMD-0603]
R3  30K  [RES-SMD-0603]
R4  value 100K  [RES-SMD-0603]  (hidden comment: RES 100K 5% 1/10W 0603)
R5  270K  [RES-SMD-0603]
R6  30k  [RES-SMD-0603]
R7  1K  [RES-SMD-0603]
U1  TI TPS563203DRLR  [SOT50P160X60-6N]
U2  TI TPS563203DRLR  [SOT50P160X60-6N]
U3  AP2112K-3.3TRG1  [SOT_RG1_DIO]

## Nets
3V3: C16.2 C17.2 FB1.1 U3.5(VOUT)
4V5: C4.2 C5.2 C6.2 C7.2 F1.1 L1.2 R2.2
4V5A: C15.2 D2.1(A) F1.2 U3.1(VIN) U3.3(EN)
6V: C11.2 C12.2 C13.2 C14.2 L2.2 R5.2
+12: D1.1(A) JDC1.1(T)
D3V3: C18.2 C19.1 FB1.2
GND: C2.1 C3.1 C5.1 C6.1 C7.1 C9.1 C10.1 C12.1 C13.1 C14.1 C15.1 C16.1 C17.1 C18.1 C19.2 JDC1.2(TN) JDC1.3(S) R3.1 R6.1 R7.2 U1.3(GND) U2.3(GND) U3.2(GND)
VIN: C2.2 C3.2 C9.2 C10.2 D1.2(K) R1.2 R4.2 U1.1(IN) U2.1(IN)
NetC1_1: C1.1 L1.1 U1.2(SW)
NetC1_2: C1.2 U1.4(BST)
NetC4_1: C4.1 R2.1 R3.2 U1.6(FB)
NetC8_1: C8.1 L2.1 U2.2(SW)
NetC8_2: C8.2 U2.4(BST)
NetC11_1: C11.1 R5.1 R6.2 U2.6(FB)
NetD2_2: D2.2(K) R7.1
NetR1_1: R1.1 U1.5(EN)
NetR4_1: R4.1 U2.5(EN)

## Notes on the sheet
- (in symbol DCIN) +DC; -DC

## Library data of the parts
C1 C8 = CAPCER0001 100nF 10% 50V X7R 0603 SMD_1: CAP CER 100nF 10% 50V X7R 0603 SMD; LINE: SMT; TYPE: EP; UNIT: PCS; TMG CODE: None; CERTIFICATION: NA; CLASS: B; Value: 100n; MOUNT: SMD; TMG PN: CAPCER0001; ComponentLink1Description: Datasheet; ComponentLink1URL: https://datasheet.lcsc.com/lcsc/1811021431_Samsung-Electro-Mechanics-CL10B104KB8NNNC_C1591.pdf; Footprint: 0603
C2 C10 = CL10A106MQ8NNNC: Description; Manufacturer_Name: Samsung; Copyright: Copyright (C) 2026 Ultra Librarian. All rights reserved.; Manufacturer_Part_Number: CL10A106MQ8NNNC
  C2: Value: 10uF
C3 C9 = CL10A106MQ8NNNC: Description; Manufacturer_Name: Samsung; Value: 10u; Copyright: Copyright (C) 2026 Ultra Librarian. All rights reserved.; Manufacturer_Part_Number: CL10A106MQ8NNNC
C4 = CAPCER0001 100nF 10% 50V X7R 0603 SMD: CAP CER 100nF 10% 50V X7R 0603 SMD; LINE: SMT; TYPE: EP; UNIT: PCS; TMG CODE: None; CERTIFICATION: NA; CLASS: B; MOUNT: SMD; TMG PN: CAPCER0001; ComponentLink1Description: Datasheet; ComponentLink1URL: https://datasheet.lcsc.com/lcsc/1811021431_Samsung-Electro-Mechanics-CL10B104KB8NNNC_C1591.pdf; Footprint: 0603
C5-C7 C12 C13 = GRM188R60J226MEA0D: Description; Manufacturer_Name: Murata; Value: 22u; Copyright: Copyright (C) 2026 Ultra Librarian. All rights reserved.; Manufacturer_Part_Number: GRM188R60J226MEA0D
C11 = CAPCER0001 100nF 10% 50V X7R 0603 SMD: CAP CER 100nF 10% 50V X7R 0603 SMD; LINE: SMT; TYPE: EP; UNIT: PCS; TMG CODE: None; CERTIFICATION: NA; CLASS: B; Value: 100n; MOUNT: SMD; TMG PN: CAPCER0001; ComponentLink1Description: Datasheet; ComponentLink1URL: https://datasheet.lcsc.com/lcsc/1811021431_Samsung-Electro-Mechanics-CL10B104KB8NNNC_C1591.pdf; Footprint: 0603
C14 = GRM188R60J226MEA0D: Description; Manufacturer_Name: Murata; Copyright: Copyright (C) 2026 Ultra Librarian. All rights reserved.; Manufacturer_Part_Number: GRM188R60J226MEA0D
C15 C17 C18 = GMC10X7R106K10NT: CAP0603 X7R 10UF 10% 10V; manufacturer: Cal-Chip Electronics, Inc.; Capacitance: 10 µF; Part Number: GMC10X7R106K10NT; Value: 10u; Applications: General Purpose; componentlink1description: Datasheet; componentlink1url: https://88ce57.p3cdn1.secureserver.net/wp-content/uploads/2023/01/gmc_series-2.pdf; componentlink2description: DigiKey Link; componentlink2url: https://www.digikey.com/en/products/detail/cal-chip-electronics-inc/GMC10X7R106K10NT/18151126; Device Package: 0603 (1608 Metric); lastupdated: 2/9/2024 8:09:39 PM; Lifecycle Status: Active; Minimum Order: 1; Mounting Type: Surface Mount, MLCC; Operating Temperature: -55°C ~ 125°C; Package / Case: 0603 (1608 Metric); packaging: TapeAndReel; partid: 49835; Part Status: Active; price: 0.26; series: GMC; Size / Dimension: 0.063" L x 0.031" W (1.60mm x 0.80mm); Supplier 1: DigiKey; Supplier Part Number 1: 4713-GMC10X7R106K10NTCT-ND; Temperature Coefficient: X7R; Thickness (Max): 0.039" (1.00mm); Tolerance: ±10%; Voltage - Rated: 10V
C16 = GMC10X7R106K10NT: CAP0603 X7R 100nF 10% 10V; manufacturer: Cal-Chip Electronics, Inc.; Capacitance: 10 µF; Part Number: GMC10X7R106K10NT; Value: 100n; Applications: General Purpose; componentlink1description: Datasheet; componentlink1url: https://88ce57.p3cdn1.secureserver.net/wp-content/uploads/2023/01/gmc_series-2.pdf; componentlink2description: DigiKey Link; componentlink2url: https://www.digikey.com/en/products/detail/cal-chip-electronics-inc/GMC10X7R106K10NT/18151126; Device Package: 0603 (1608 Metric); lastupdated: 2/9/2024 8:09:39 PM; Lifecycle Status: Active; Minimum Order: 1; Mounting Type: Surface Mount, MLCC; Operating Temperature: -55°C ~ 125°C; Package / Case: 0603 (1608 Metric); packaging: TapeAndReel; partid: 49835; Part Status: Active; price: 0.26; series: GMC; Size / Dimension: 0.063" L x 0.031" W (1.60mm x 0.80mm); Supplier 1: DigiKey; Supplier Part Number 1: 4713-GMC10X7R106K10NTCT-ND; Temperature Coefficient: X7R; Thickness (Max): 0.039" (1.00mm); Tolerance: ±10%; Voltage - Rated: 10V
C19 = UWT1C101MCL1GB: CAP ALUM 100UF 20% / 16V SMD; Supplier 1: Digi-Key; Supplier Part Number 1: 493-2177-2-ND
D1 = SS34: Schottky Diode 40V 3A SMA; Supplier 1: Digi-Key; Supplier Part Number 1: SS34-E3/57TGICT-ND; Value: SS34
D2 = LTST-C190KRKT: Lite-On LED Red 0603; Supplier Part Number 1: 160-1436-1-ND; Supplier 1: Digi-Key; Supplier Part Number 2: FL1413
F1 = C1F5: Fuse Chip Fast Acting 5A 125V SMD Solder Pad 1206 3.2 X 1.58 X 0.63mm; Manufacturer: Bel TRP; Voltage Rating (DC): 63V; DC Cold Resistance: 20mR; Fuse Type: Board Mount (Cartridge Style Excluded); Supplier 1: Newark; Manufacturer Part Number: C1F5; RoHS: Yes; Category: Uncategorized; Mount: Surface Mount; Case/Package: 1206; Number of Pins: 2; Contact Plating: Tin; Case Code (Metric): 3216; Case Code (Imperial): 1206; Min Operating Temperature: -55°C; Max Operating Temperature: 125°C; Packaging: Cut Tape; Voltage Rating: 125V; Series: C1F; Voltage Rating (AC): 125V; ComponentLink1URL: http://www.mouser.com/ds/2/643/C1F-594910.pdf?src-supplier=Mouser; ComponentLink1Description: http://www.mouser.com/ds/2/643/C1F-594910.pdf?src-supplier=Mouser; ComponentLink2URL: http://belfuse.com/pdfs/C1F.pdf?src-supplier=Avnet; ComponentLink2Description: http://belfuse.com/pdfs/C1F.pdf?src-supplier=Avnet; ComponentLink3URL: https://belfuse.com/resources/datasheets/circuitprotection/ds-cp-c1f-series.pdf?src-supplier=Digikey; ComponentLink3Description: https://belfuse.com/resources/datasheets/circuitprotection/ds-cp-c1f-series.pdf?src-supplier=Digikey; Supplier Part Number 1: 48AC8480
FB1 = BLM18KG331SH1D: FERRITE BEAD 330 OHM 0603 1LN; Manufacturer: Murata Electronics; Current Rating (Max): 1.7A; DC Resistance (DCR) (Max): 80mOhm; Filter Type: Power Line; Impedance @ Frequency: 330 Ohms @ 100 MHz; Number of Lines: 1; Part Number: BLM18KG331SH1D; ComponentLink1Description: Datasheet; ComponentLink1URL: https://www.murata.com/en-global/products/productdata/8796737273886/QNFA9101.pdf; ComponentLink2Description: DigiKey Link; ComponentLink2URL: https://www.digikey.com/en/products/detail/murata-electronics/BLM18KG331SH1D/5881246; Device Package: 0603 (1608 Metric); Height (Max): 0.037" (0.95mm); LastUpdated: 3/11/2024 7:43:28 AM; Lifecycle Status: Active; Minimum Order: 1; Mounting Type: Surface Mount; Operating Temperature: -55°C ~ 125°C; Package / Case: 0603 (1608 Metric); Packaging: TapeAndReel; PartId: 932; Part Status: Active; Price: 0.02; Ratings: AEC-Q200; Series: EMIFIL®, BLM18; Size / Dimension: 0.063" L x 0.032" W (1.60mm x 0.80mm); Supplier 1: DigiKey; Supplier Part Number 1: 490-13257-1-ND; Value: 330
JDC1 = DCIN: Jac DC input; Value: Jac DC
L1 L2 = INDMOI0016 1W2T 2.2uH 20% 5A 0420 SMD: IND MOI 1W2T 4.7uH 20% 5A 0420 SMD; LINE: SMT; TYPE: EP; UNIT: PCS; TMG CODE: None; CERTIFICATION: NA; CLASS: B; MOUNT: SMD; ComponentLink1Description: Datasheet; ComponentLink1URL: https://datasheet.lcsc.com/lcsc/2305161117_cjiang--Changjiang-Microelectronics-Tech-FXL0420-2R2-M_C167206.pdf
R1 R4 = RC0603JR-07100KL: Yageo RES 100K 5% 1/10W 0603; Supplier 1: Digi-Key; Supplier Part Number 1: 311-100KGRCT-ND; Supplier Part Number 2: FL2402
R2 R3 R5 R6 = RESCHP0195 2K7 1% 0603 SMD: RES CHP 2K7 1% 1/10W 0603 SMD; LINE: SMT; UNIT: PCS; TMG CODE: None; CERTIFICATION: NA; CLASS: B; MOUNT: SMD; TYPE: EP; TMG PN: RESCHP0195; ComponentLink1Description: Datasheet; ComponentLink1URL: https://datasheet.lcsc.com/lcsc/2304140030_YAGEO-RC0603FR-072K7L_C114612.pdf; Footprint: 0603
  R3: Value: 30k
R7 = Resistor 2.2K: Res Thick Film 0603 2.2K Ohm 5% 1/10W ±200ppm/°C Molded SMD SMD Paper T/R; Manufacturer: Vishay; Manufacturer Part Number: CRCW06032K20JNEA; Resistance: 2.2kR; Power Rating: 100mW; Voltage Rating: 75V; Supplier 1: Arrow Electronics; RoHS: Yes; Category: Chip SMD Resistors; Stock 1: 130000; Pricing 1: 5000=0.0053 (USD); Case/Package: 0603; Weight: 7.1E-05oz; Case Code (Metric): 1608; Case Code (Imperial): 0603; Contact Plating: Tin; Size Code: 0603; Min Operating Temperature: -55°C; Max Operating Temperature: 155°C; Package Quantity: 5000; Tolerance: 5%; Packaging: Tape and Reel; Resistor Type: Thick Film; Number of Terminations: 2; Temperature Coefficient: 200ppm/°C; Termination: SMD/SMT; Max Power Dissipation: 100mW; Features: Automotive AEC-Q200; Series: CRCW; Resistance Tolerance: 5%; Construction: Rectangular; Length: 1.55mm; Width: 0.85mm; Height: 0.45mm; Depth: 0.85mm; Ratings: AEC-Q200; Radiation Hardening: No; Military Standard: Not; RoHS Compliant: Yes; Reach SVHC Compliant: Unknown; Lead Free: 5697LeadFree; ComponentLink1URL: https://datasheet.ciiva.com/2462/dcrcwe3-2462048.pdf?src-supplier=Digikey; ComponentLink1Description: https://datasheet.ciiva.com/2462/dcrcwe3-2462048.pdf?src-supplier=Digikey; ComponentLink2URL: https://datasheet.ciiva.com/16767/70201119-16767464.pdf?src-supplier=Allied+Electronics; ComponentLink2Description: https://datasheet.ciiva.com/16767/70201119-16767464.pdf?src-supplier=Allied+Electronics; ComponentLink3URL: https://datasheet.ciiva.com/2462/dcrcwe3-2462046.pdf?src-supplier=Digikey; ComponentLink3Description: https://datasheet.ciiva.com/2462/dcrcwe3-2462046.pdf?src-supplier=Digikey; ComponentLink4URL: https://datasheet.ciiva.com/5541/dcrcwe3-109170-5541959.pdf?src-supplier=Mouser; ComponentLink4Description: https://datasheet.ciiva.com/5541/dcrcwe3-109170-5541959.pdf?src-supplier=Mouser; ComponentLink5URL: https://datasheet.ciiva.com/16286/dcrcwe3-16286997.pdf?src-supplier=Future+Electronics; ComponentLink5Description: https://datasheet.ciiva.com/16286/dcrcwe3-16286997.pdf?src-supplier=Future+Electronics; Supplier Part Number 1: CRCW06032K20JNEA; Value: 1K
U1 U2 = ICSOCV0021 BCK TPS563201 3A SOT23-6 SMD: ICS OCV BCK TPS563201 3A SOT23-6 SMD; LINE: SMT; UNIT: PCS; TMG CODE: None; CERTIFICATION: NA; CLASS: B; MOUNT: SMD; TYPE: EP; ComponentLink1Description: Datasheet; ComponentLink1URL: https://datasheet.lcsc.com/lcsc/2304241919_Texas-Instruments-TPS563201DDCR_C116592.pdf
U3 = AP2112K-3.3TRG1: AP2112 Series 0.6 A 3.3 V Fixed Output SMT LDO Linear Regulator - SOT23-5; MF: Diodes Inc.; Value: 1K; Availability: Unavailable; Package: SOT-753 Diodes Inc.; Price: None; SnapEDA_Link: https://www.snapeda.com/parts/AP2112K-3.3TRG1/Diodes%20Inc./view-part/?ref=snap; MP: AP2112K-3.3TRG1